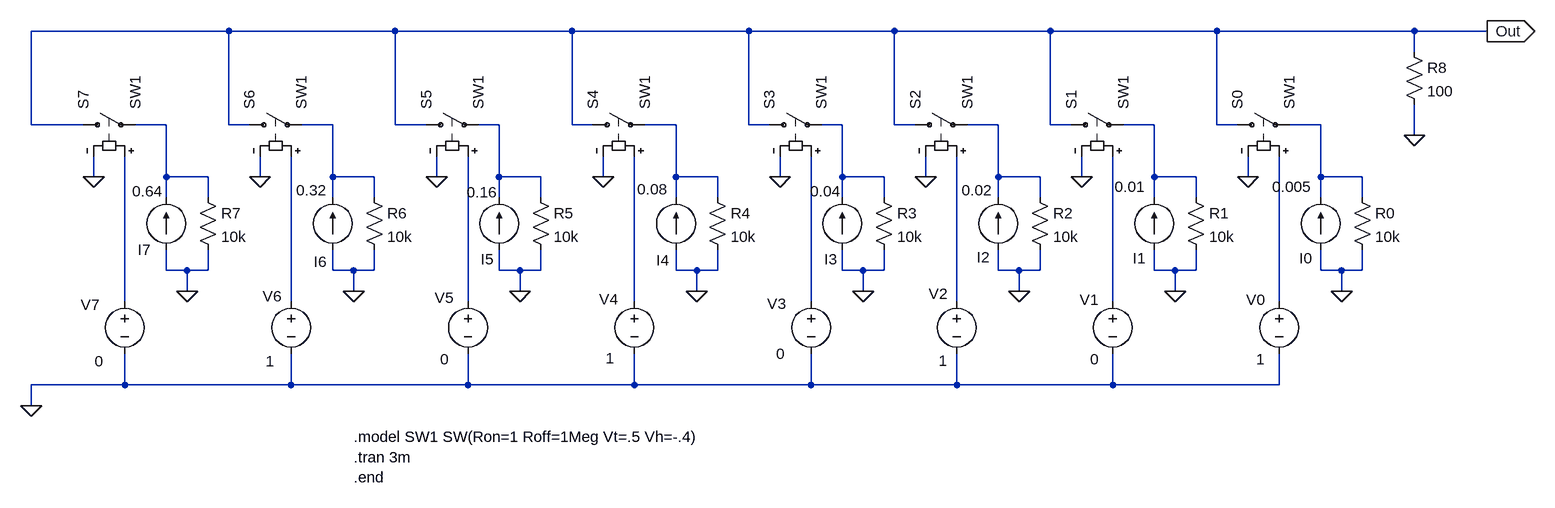
[diagram p0: schematic current steering dac.asc]
current steering dac.asc, the LTspice schematic file:
Version 4
SHEET 1 1648 704
WIRE -832 -32 -1136 -32
WIRE -576 -32 -832 -32
WIRE -304 -32 -576 -32
WIRE -32 -32 -304 -32
WIRE 192 -32 -32 -32
WIRE 432 -32 192 -32
WIRE 688 -32 432 -32
WIRE 992 -32 688 -32
WIRE 1104 -32 992 -32
WIRE 992 0 992 -32
WIRE -1136 112 -1136 -32
WIRE -1056 112 -1136 112
WIRE -928 112 -976 112
WIRE -832 112 -832 -32
WIRE -800 112 -832 112
WIRE -672 112 -720 112
WIRE -576 112 -576 -32
WIRE -528 112 -576 112
WIRE -416 112 -448 112
WIRE -304 112 -304 -32
WIRE -272 112 -304 112
WIRE -144 112 -192 112
WIRE -32 112 -32 -32
WIRE 0 112 -32 112
WIRE 112 112 80 112
WIRE 192 112 192 -32
WIRE 224 112 192 112
WIRE 352 112 304 112
WIRE 432 112 432 -32
WIRE 464 112 432 112
WIRE 592 112 544 112
WIRE 688 112 688 -32
WIRE 720 112 688 112
WIRE 848 112 800 112
WIRE 992 128 992 80
WIRE -1040 192 -1040 160
WIRE -928 192 -928 112
WIRE -864 192 -928 192
WIRE -784 192 -784 160
WIRE -672 192 -672 112
WIRE -608 192 -672 192
WIRE -512 192 -512 160
WIRE -416 192 -416 112
WIRE -352 192 -416 192
WIRE -256 192 -256 160
WIRE -144 192 -144 112
WIRE -80 192 -144 192
WIRE 16 192 16 160
WIRE 112 192 112 112
WIRE 176 192 112 192
WIRE 240 192 240 160
WIRE 352 192 352 112
WIRE 416 192 352 192
WIRE 480 192 480 160
WIRE 592 192 592 112
WIRE 656 192 592 192
WIRE 736 192 736 160
WIRE 848 192 848 112
WIRE 912 192 848 192
WIRE -928 224 -928 192
WIRE -864 224 -864 192
WIRE -672 224 -672 192
WIRE -608 224 -608 192
WIRE -416 224 -416 192
WIRE -352 224 -352 192
WIRE -144 224 -144 192
WIRE -80 224 -80 192
WIRE 112 224 112 192
WIRE 176 224 176 192
WIRE 352 224 352 192
WIRE 416 224 416 192
WIRE 592 224 592 192
WIRE 656 224 656 192
WIRE 848 224 848 192
WIRE 912 224 912 192
WIRE -928 336 -928 304
WIRE -896 336 -928 336
WIRE -864 336 -864 304
WIRE -864 336 -896 336
WIRE -672 336 -672 304
WIRE -640 336 -672 336
WIRE -608 336 -608 304
WIRE -608 336 -640 336
WIRE -416 336 -416 304
WIRE -384 336 -416 336
WIRE -352 336 -352 304
WIRE -352 336 -384 336
WIRE -144 336 -144 304
WIRE -112 336 -144 336
WIRE -80 336 -80 304
WIRE -80 336 -112 336
WIRE 112 336 112 304
WIRE 144 336 112 336
WIRE 176 336 176 304
WIRE 176 336 144 336
WIRE 352 336 352 304
WIRE 384 336 352 336
WIRE 416 336 416 304
WIRE 416 336 384 336
WIRE 592 336 592 304
WIRE 624 336 592 336
WIRE 656 336 656 304
WIRE 656 336 624 336
WIRE 848 336 848 304
WIRE 880 336 848 336
WIRE 912 336 912 304
WIRE 912 336 880 336
WIRE -896 368 -896 336
WIRE -640 368 -640 336
WIRE -384 368 -384 336
WIRE -112 368 -112 336
WIRE 144 368 144 336
WIRE 384 368 384 336
WIRE 624 368 624 336
WIRE 880 368 880 336
WIRE -992 384 -992 160
WIRE -736 384 -736 160
WIRE -464 384 -464 160
WIRE -208 384 -208 160
WIRE 64 384 64 160
WIRE 288 384 288 160
WIRE 528 384 528 160
WIRE 784 384 784 160
WIRE -992 512 -992 464
WIRE -992 512 -1136 512
WIRE -736 512 -736 464
WIRE -736 512 -992 512
WIRE -464 512 -464 464
WIRE -464 512 -736 512
WIRE -208 512 -208 464
WIRE -208 512 -464 512
WIRE 64 512 64 464
WIRE 64 512 -208 512
WIRE 288 512 288 464
WIRE 288 512 64 512
WIRE 528 512 528 464
WIRE 528 512 288 512
WIRE 784 512 784 464
WIRE 784 512 528 512
WIRE -1136 544 -1136 512
FLAG -1136 544 0
FLAG 1104 -32 Out
IOPIN 1104 -32 Out
FLAG -1040 192 0
FLAG 992 128 0
FLAG 240 192 0
FLAG 16 192 0
FLAG 144 368 0
FLAG 384 368 0
FLAG -112 368 0
FLAG -384 368 0
FLAG 624 368 0
FLAG -640 368 0
FLAG -896 368 0
FLAG -784 192 0
FLAG -256 192 0
FLAG -512 192 0
FLAG 480 192 0
FLAG 880 368 0
FLAG 736 192 0
SYMBOL sw 448 112 R270
SYMATTR InstName S1
SYMATTR Value SW1
SYMBOL sw 208 112 R270
SYMATTR InstName S2
SYMATTR Value SW1
SYMBOL sw -16 112 R270
SYMATTR InstName S3
SYMATTR Value SW1
SYMBOL sw -288 112 R270
SYMATTR InstName S4
SYMATTR Value SW1
SYMBOL sw -544 112 R270
SYMATTR InstName S5
SYMATTR Value SW1
SYMBOL sw -816 112 R270
SYMATTR InstName S6
SYMATTR Value SW1
SYMBOL sw -1072 112 R270
SYMATTR InstName S7
SYMATTR Value SW1
SYMBOL voltage 528 368 R0
WINDOW 123 0 0 Left 2
WINDOW 39 0 0 Left 2
WINDOW 0 -51 13 Left 2
WINDOW 3 -35 105 Left 2
SYMATTR InstName V1
SYMATTR Value 0
SYMBOL voltage 288 368 R0
WINDOW 123 0 0 Left 2
WINDOW 39 0 0 Left 2
WINDOW 0 -43 4 Left 2
WINDOW 3 -28 107 Left 2
SYMATTR InstName V2
SYMATTR Value 1
SYMBOL voltage 64 368 R0
WINDOW 123 0 0 Left 2
WINDOW 39 0 0 Left 2
WINDOW 0 -38 19 Right 2
WINDOW 3 -54 96 Left 2
SYMATTR InstName V3
SYMATTR Value 0
SYMBOL voltage -208 368 R0
WINDOW 123 0 0 Left 2
WINDOW 39 0 0 Left 2
WINDOW 0 -54 12 Left 2
WINDOW 3 -44 103 Left 2
SYMATTR InstName V4
SYMATTR Value 1
SYMBOL voltage -464 368 R0
WINDOW 123 0 0 Left 2
WINDOW 39 0 0 Left 2
WINDOW 0 -51 10 Left 2
WINDOW 3 -43 105 Left 2
SYMATTR InstName V5
SYMATTR Value 0
SYMBOL voltage -736 368 R0
WINDOW 123 0 0 Left 2
WINDOW 39 0 0 Left 2
WINDOW 0 -44 8 Left 2
WINDOW 3 -39 108 Left 2
SYMATTR InstName V6
SYMATTR Value 1
SYMBOL voltage -992 368 R0
WINDOW 123 0 0 Left 2
WINDOW 39 0 0 Left 2
WINDOW 0 -68 21 Left 2
WINDOW 3 -46 108 Left 2
SYMATTR InstName V7
SYMATTR Value 0
SYMBOL current 592 304 R180
WINDOW 123 0 0 Left 2
WINDOW 39 0 0 Left 2
WINDOW 0 13 -13 Left 2
WINDOW 3 14 97 Left 2
SYMATTR InstName I1
SYMATTR Value 0.01
SYMBOL current 352 304 R180
WINDOW 123 0 0 Left 2
WINDOW 39 0 0 Left 2
WINDOW 0 13 -12 Left 2
WINDOW 3 9 91 Left 2
SYMATTR InstName I2
SYMATTR Value 0.02
SYMBOL current 112 304 R180
WINDOW 123 0 0 Left 2
WINDOW 39 0 0 Left 2
WINDOW 0 8 -15 Left 2
WINDOW 3 2 90 Left 2
SYMATTR InstName I3
SYMATTR Value 0.04
SYMBOL current -144 304 R180
WINDOW 123 0 0 Left 2
WINDOW 39 0 0 Left 2
WINDOW 0 10 -16 Left 2
WINDOW 3 12 93 Left 2
SYMATTR InstName I4
SYMATTR Value 0.08
SYMBOL current -416 304 R180
WINDOW 123 0 0 Left 2
WINDOW 39 0 0 Left 2
WINDOW 0 8 -15 Left 2
WINDOW 3 3 88 Left 2
SYMATTR InstName I5
SYMATTR Value 0.16
SYMBOL current -672 304 R180
WINDOW 123 0 0 Left 2
WINDOW 39 0 0 Left 2
WINDOW 0 9 -19 Left 2
WINDOW 3 9 91 Left 2
SYMATTR InstName I6
SYMATTR Value 0.32
SYMBOL current -928 304 R180
WINDOW 123 0 0 Left 2
WINDOW 39 0 0 Left 2
WINDOW 3 5 90 Left 2
SYMATTR Value 0.64
SYMATTR InstName I7
SYMBOL res 976 -16 R0
SYMATTR InstName R8
SYMATTR Value 100
SYMBOL res 640 208 R0
SYMATTR InstName R1
SYMATTR Value 10k
SYMBOL res 400 208 R0
SYMATTR InstName R2
SYMATTR Value 10k
SYMBOL res 160 208 R0
SYMATTR InstName R3
SYMATTR Value 10k
SYMBOL res -96 208 R0
SYMATTR InstName R4
SYMATTR Value 10k
SYMBOL res -368 208 R0
SYMATTR InstName R5
SYMATTR Value 10k
SYMBOL res -624 208 R0
SYMATTR InstName R6
SYMATTR Value 10k
SYMBOL res -880 208 R0
SYMATTR InstName R7
SYMATTR Value 10k
SYMBOL sw 704 112 R270
SYMATTR InstName S0
SYMATTR Value SW1
SYMBOL voltage 784 368 R0
WINDOW 123 0 0 Left 2
WINDOW 39 0 0 Left 2
WINDOW 0 -51 13 Left 2
WINDOW 3 -35 105 Left 2
SYMATTR InstName V0
SYMATTR Value 1
SYMBOL current 848 304 R180
WINDOW 123 0 0 Left 2
WINDOW 39 0 0 Left 2
WINDOW 0 13 -13 Left 2
WINDOW 3 14 97 Left 2
SYMATTR InstName I0
SYMATTR Value 0.005
SYMBOL res 896 208 R0
SYMATTR InstName R0
SYMATTR Value 10k
TEXT -640 592 Left 2 !.model SW1 SW(Ron=1 Roff=1Meg Vt=.5 Vh=-.4)\n.tran 3m\n.end

The netlist it stands for:
* current steering dac.asc
S1 Out N007 N015 0 SW1
S2 Out N006 N014 0 SW1
S3 Out N005 N013 0 SW1
S4 Out N004 N012 0 SW1
S5 Out N003 N011 0 SW1
S6 Out N002 N010 0 SW1
S7 Out N001 N009 0 SW1
V1 N015 0 0
V2 N014 0 1
V3 N013 0 0
V4 N012 0 1
V5 N011 0 0
V6 N010 0 1
V7 N009 0 0
I1 0 N007 0.01
I2 0 N006 0.02
I3 0 N005 0.04
I4 0 N004 0.08
I5 0 N003 0.16
I6 0 N002 0.32
I7 0 N001 0.64
R8 Out 0 100
R1 N007 0 10k
R2 N006 0 10k
R3 N005 0 10k
R4 N004 0 10k
R5 N003 0 10k
R6 N002 0 10k
R7 N001 0 10k
S0 Out N008 N016 0 SW1
V0 N016 0 1
I0 0 N008 0.005
R0 N008 0 10k
.model SW1 SW(Ron=1 Roff=1Meg Vt=.5 Vh=-.4)
.tran 3m
.end
.backanno
.end